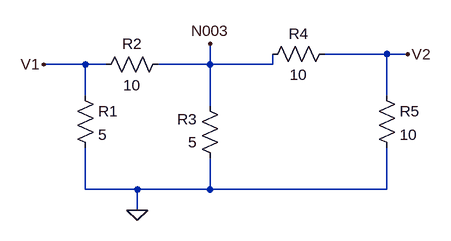
[diagram p0: schematic CircuitoPrueba1.asc]
CircuitoPrueba1.asc, the LTspice schematic file:
Version 4
SHEET 1 1200 680
WIRE 544 64 448 64
WIRE 576 64 544 64
WIRE 80 80 16 80
WIRE 112 80 80 80
WIRE 272 80 272 48
WIRE 272 80 192 80
WIRE 368 80 368 64
WIRE 368 80 272 80
WIRE 80 128 80 80
WIRE 544 128 544 64
WIRE 272 144 272 80
WIRE 80 272 80 208
WIRE 160 272 80 272
WIRE 272 272 272 224
WIRE 272 272 160 272
WIRE 544 272 544 208
WIRE 544 272 272 272
WIRE 160 304 160 272
FLAG 160 304 0
FLAG 16 80 V1
FLAG 576 64 V2
FLAG 272 48 N003
SYMBOL res 208 64 R90
WINDOW 0 0 56 VBottom 2
WINDOW 3 32 56 VTop 2
SYMATTR InstName R2
SYMATTR Value 10
SYMBOL res 464 48 R90
WINDOW 0 0 56 VBottom 2
WINDOW 3 32 56 VTop 2
SYMATTR InstName R4
SYMATTR Value 10
SYMBOL res 288 240 R180
WINDOW 0 36 76 Left 2
WINDOW 3 36 40 Left 2
SYMATTR InstName R3
SYMATTR Value 5
SYMBOL res 64 112 R0
SYMATTR InstName R1
SYMATTR Value 5
SYMBOL res 528 112 R0
SYMATTR InstName R5
SYMATTR Value 10

The netlist it stands for:
* CircuitoPrueba1.asc
R2 N003 V1 10
R4 V2 N003 10
R3 0 N003 5
R1 V1 0 5
R5 V2 0 10
.backanno
.end